# EAGLE design dotstar4 (EAGLE 9.6.2)
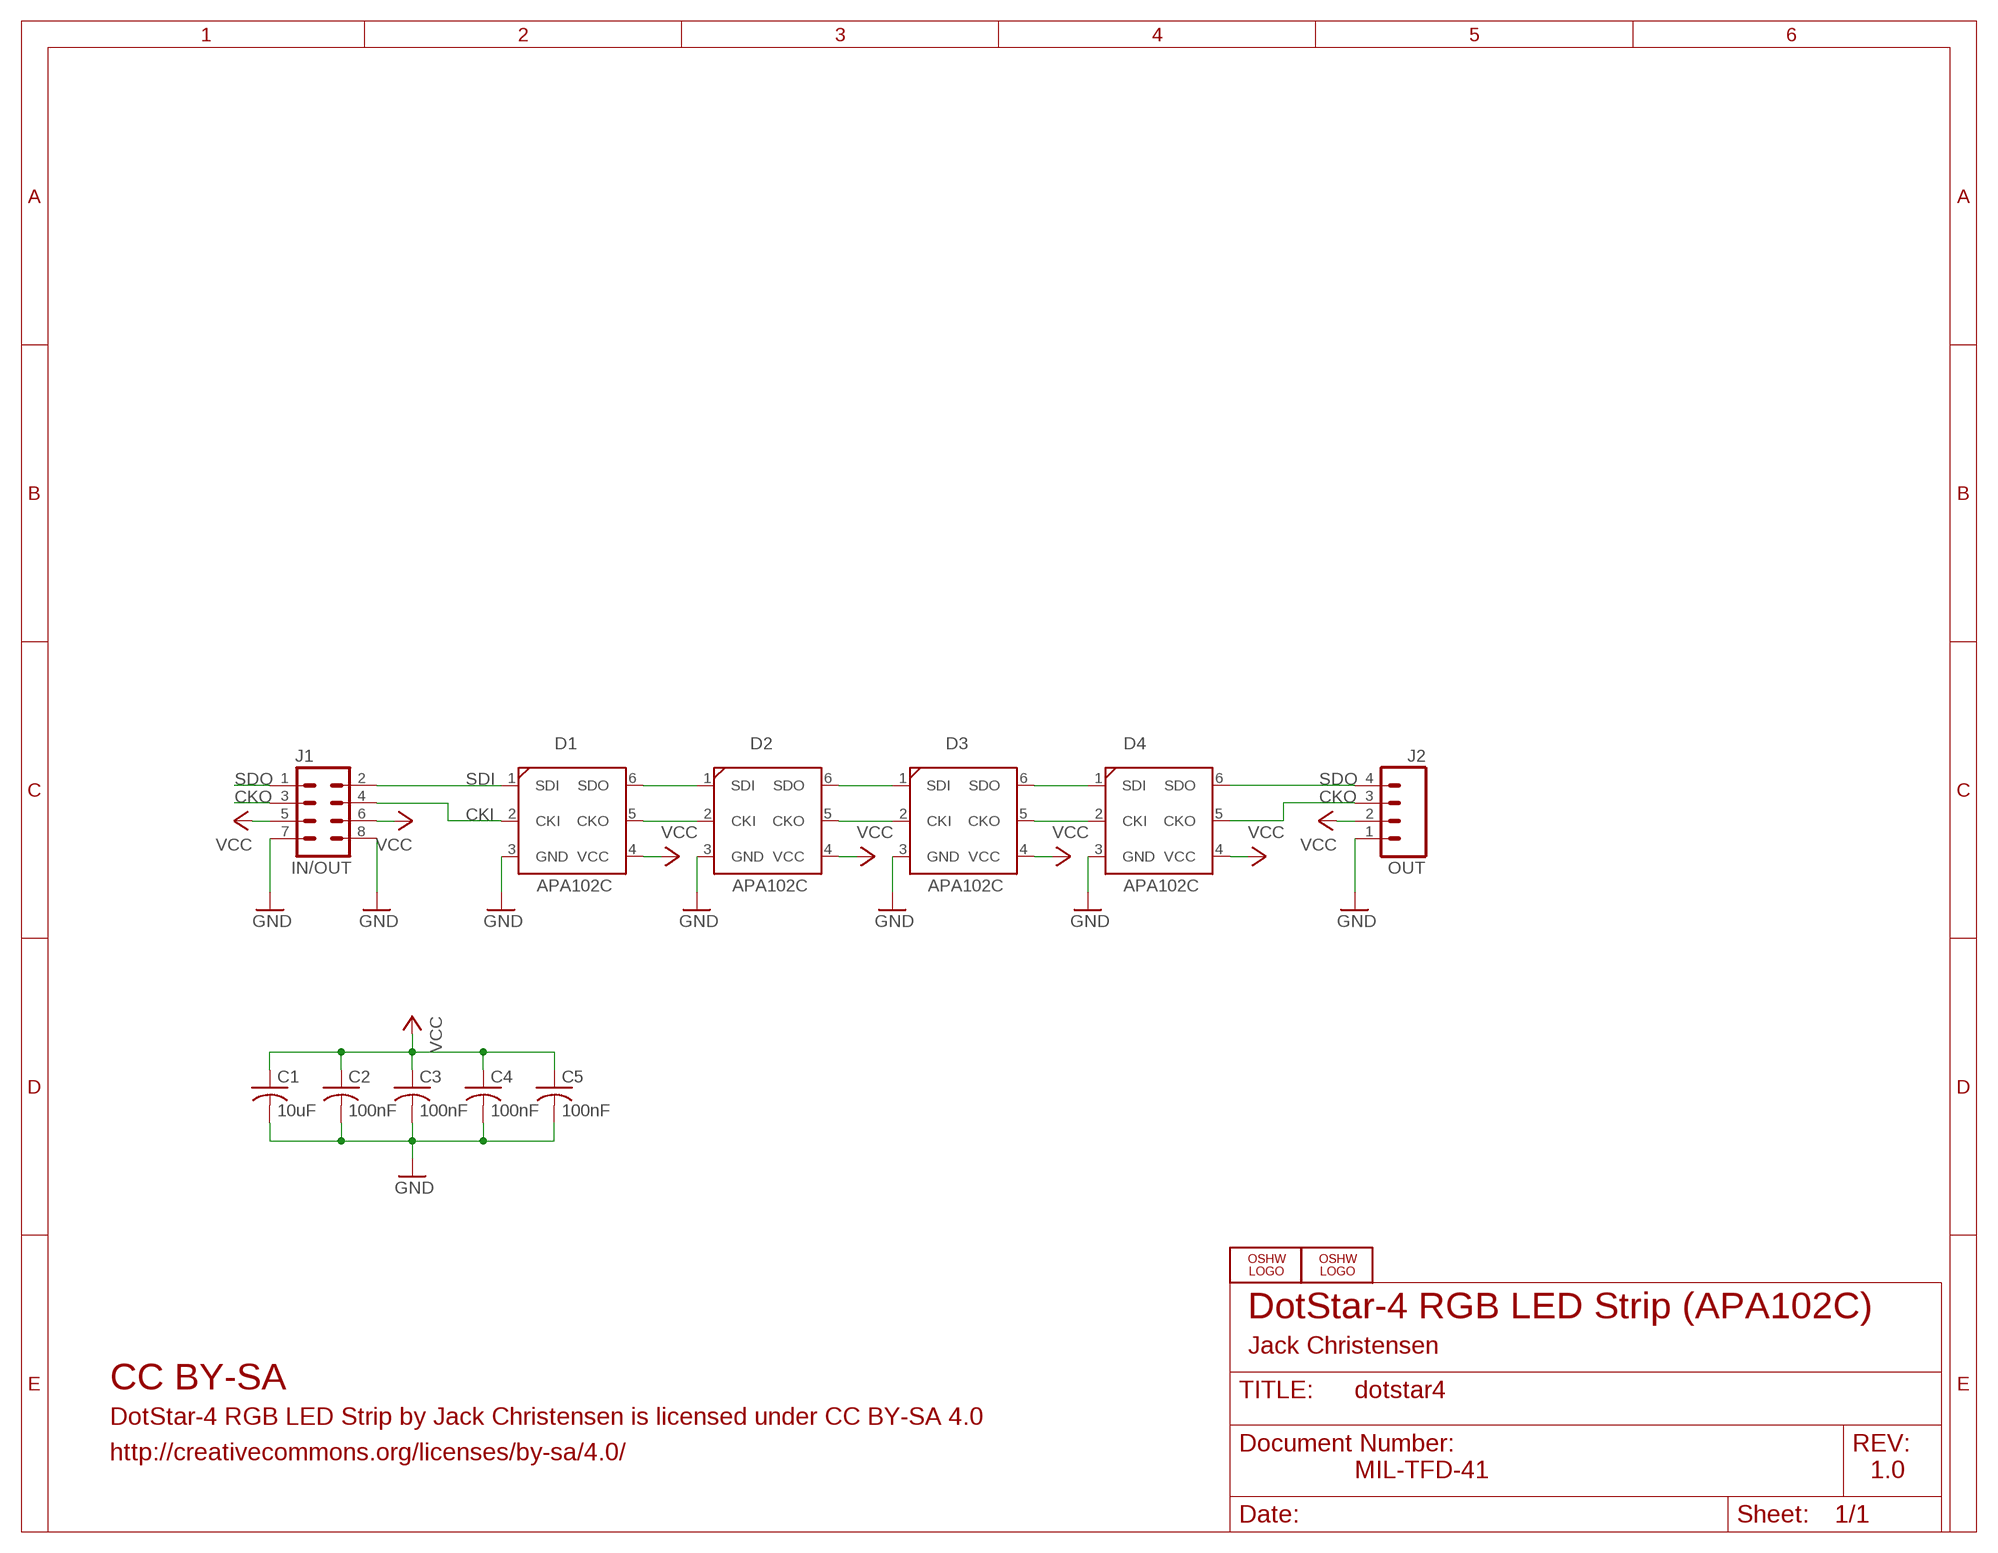
[diagram p0: schematic, sheet 1]

## Parts
C1  10uF  C-USM0805  [M0805]
C2  100nF  C-USM0805  [M0805]
C3  100nF  C-USM0805  [M0805]
C4  100nF  C-USM0805  [M0805]
C5  100nF  C-USM0805  [M0805]
D1  APA102C  [RGB5050]
D2  APA102C  [RGB5050]
D3  APA102C  [RGB5050]
D4  APA102C  [RGB5050]
J1  IN/OUT  M04X2  [2X4]
J2  OUT  M04PTH  [1X04]
LOGO1  OSHW_LOGO_8MILX0150-NT  [OSHW_8X150_NOTEXT]
LOGO2  OSHW_LOGO_8MILX0150-NT  [OSHW_8X150_NOTEXT]

## Nets
CKI: D1.2(CKI) J1.4
CKO: D4.5(CKO) J1.3 J2.3
GND: C1.2 C2.2 C3.2 C4.2 C5.2 D1.3(GND) D2.3(GND) D3.3(GND) D4.3(GND) J1.7 J1.8 J2.1
N$1: D1.5(CKO) D2.2(CKI)
N$2: D1.6(SDO) D2.1(SDI)
N$3: D2.5(CKO) D3.2(CKI)
N$4: D2.6(SDO) D3.1(SDI)
N$5: D3.5(CKO) D4.2(CKI)
N$6: D3.6(SDO) D4.1(SDI)
SDI: D1.1(SDI) J1.2
SDO: D4.6(SDO) J1.1 J2.4
VCC: C1.1 C2.1 C3.1 C4.1 C5.1 D1.4(VCC) D2.4(VCC) D3.4(VCC) D4.4(VCC) J1.5 J1.6 J2.2

## Notes on the sheet
- DotStar-4 RGB LED Strip (APA102C)
- Jack Christensen
- CC BY-SA
- DotStar-4 RGB LED Strip by Jack Christensen is licensed under CC BY-SA 4.0
- http://creativecommons.org/licenses/by-sa/4.0/
- MIL-TFD-41 | 1.0

## Library data of the parts
C1-C5 = _jc:C-US: CAPACITOR, American symbol
D1-D4 = _jc:APA102C: APA102C Serial RGB LED
J1 = SparkFun:M04X2
J2 = SparkFun:M04: Header 4 Standard 4-pin 0.1" header. Use with straight break away headers (SKU : PRT-00116), right angle break away headers (PRT-00553), swiss pins (PRT-00743), machine pins (PRT-00117), and female headers (PRT-00115). Molex polarized connector foot print use with SKU : PRT-08231 with associated crimp pins and housings.
LOGO1 LOGO2 = ohw-logo:OSHW_LOGO_8MIL

## Board
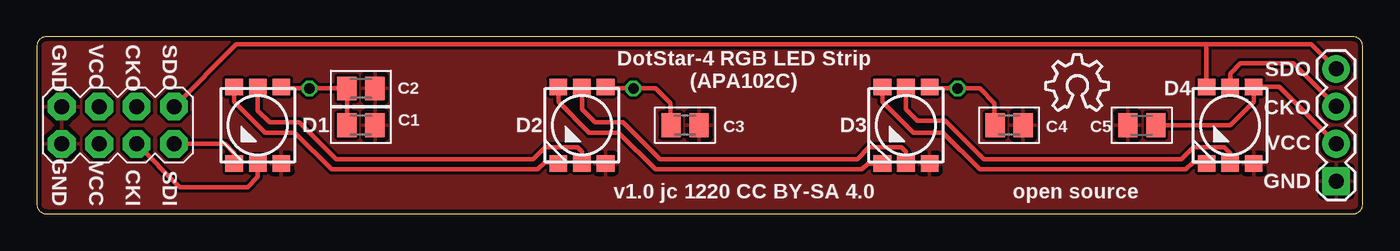
[diagram p1: board, top side]
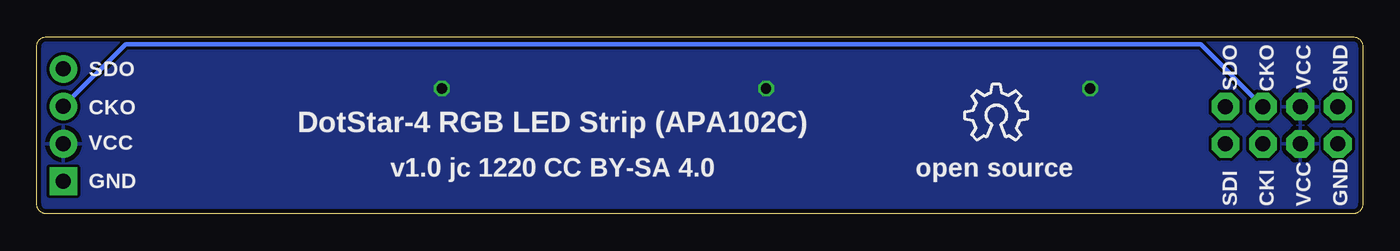
[diagram p2: board, bottom side, seen from below]

Size 90 x 12 mm. Coordinates in mm from the lower left corner, seen from the top.
Outline: 0,11.37 0,0.64 arc90 0.64,0 89.36,0 arc90 90,0.64 90,11.37 arc90 89.36,12 0.64,12 arc90 0,11.37
Copper layers (1*16): Top 0.0356mm / dielectric 1.5011mm / Bottom 0.0356mm
Design rules "oshpark-2layer-jc": minimum track width 8mil, minimum drill 13mil, track to track 8mil, track to pad 8mil, pad to pad 8mil, via to via 8mil, smd to smd 6mil, copper to edge 12mil, drill to drill 6mil, minimum pad ring 7mil, minimum via ring 7mil, stop-mask expansion 2.5mil, vias tented up to drill 20mil, thermal gap 12mil

### Footprints (pad centres in the part's own frame; a part is rotated, then mirrored left to right if it is on the bottom)
M0805 = smd 1.3 x 1.6: 1 -0.95,0; 2 0.95,0
RGB5050 = smd 1.2 x 1.1: 1 -1.6,-2.6; 2 0,-2.6; 3 1.6,-2.6; 4 1.6,2.6; 5 0,2.6; 6 -1.6,2.6
2X4 = drill 1.016 pad 1.88 octagon: 1 -3.81,-1.27; 2 -3.81,1.27; 3 -1.27,-1.27; 4 -1.27,1.27; 5 1.27,-1.27; 6 1.27,1.27; 7 3.81,-1.27; 8 3.81,1.27
1X04 = drill 1.016 pad 1.88 square: 1 0,0 | drill 1.016 pad 1.88: 2 2.54,0; 3 5.08,0; 4 7.62,0

### Placement (x,y rotation side)
C1  22,6 0 top
C2  22,8.5 0 top
C3  44,6 0 top
C4  66,6 0 top
C5  75,6 180 top
D1  15,6 0 top
D2  37,6 0 top
D3  59,6 0 top
D4  81,6 0 top
J1  5.5,6 180 top
J2  88.2,2.2 90 top
LOGO1  68.5,7 0 top
LOGO2  27,5 0 bottom

### Tracks (layer width: path | path; a pad name or v marks a point on that pad's centre or on a via)
CKI
  Top 0.305: J1.4 9.7,1.8 14.3,1.8 15,2.5 D1.2
CKO
  Top 0.305: J2.3 85.28,10.2 81.7,10.2 81,9.5 D4.5
  Bottom 0.305: J1.3 11,11.5 83.98,11.5 J2.3
GND
  pour Top: -1,13 -1,-1 91,-1 91,13
N$1
  Top 0.305: D1.5 15,7 15.8,6.2 17.8,6.2 20.3,3.7 33.7,3.7 34.5,4.5 36.7,4.5 37,4.2 D2.2
N$2
  Top 0.305: D1.6 13.4,7.6 15.5,5.5 17.5,5.5 20,3 34,3 34.5,3.5 35.3,3.5 D2.1
N$3
  Top 0.305: D2.5 37,7.1 37.9,6.2 39.8,6.2 42.3,3.7 55.7,3.7 56.5,4.5 58.7,4.5 59,4.2 D3.2
N$4
  Top 0.305: D2.6 35.4,7.6 37.5,5.5 39.5,5.5 42,3 56,3 56.4,3.4 D3.1
N$5
  Top 0.305: D3.5 59,7.1 59.79,6.31 61.69,6.31 64.3,3.7 77.7,3.7 78.5,4.5 80.6,4.5 81,4.1 D4.2
N$6
  Top 0.305: D3.6 57.4,7.6 59.5,5.5 61.5,5.5 64,3 78,3 78.5,3.5 79.3,3.5 D4.1
SDI
  Top 0.305: J1.2 12.77,4.73 13.4,4.1 D1.1
SDO
  Top 0.305: J2.4 86.52,11.5 79.4,11.5 | J1.1 13.54,11.5 79.4,11.5 | D4.6 79.4,11.5
VCC  (via drill 0.7)
  Top 0.305: J2.2 84.34,8.6 D4.4 82.6,7.6 81,6 C5.1 | D1.4 16.7,8.5 v18.5,8.5 C2.1 C1.1 | D2.4 38.7,8.5 v40.5,8.5 42,8.5 43,7.5 43,6 C3.1 | D3.4 60.7,8.5 v62.5,8.5 64,8.5 65,7.5 65,6 C4.1
  pour Bottom: -2,14 -2,-2 92,-2 92,14

### Text on the board
tPlace: GND | VCC | CKO | SDO | SDO | DotStar-4 RGB LED Strip / (APA102C) | CKO | VCC | GND | v1.0 jc 1220 CC BY-SA 4.0 | open source | GND | VCC | CKI | SDI
bPlace: GND | VCC | CKO | SDO | SDO | CKO | DotStar-4 RGB LED Strip (APA102C) | VCC | open source | v1.0 jc 1220 CC BY-SA 4.0 | GND | GND | VCC | CKI | SDI